# EAGLE schematic vceg (EAGLE 7.1.0)
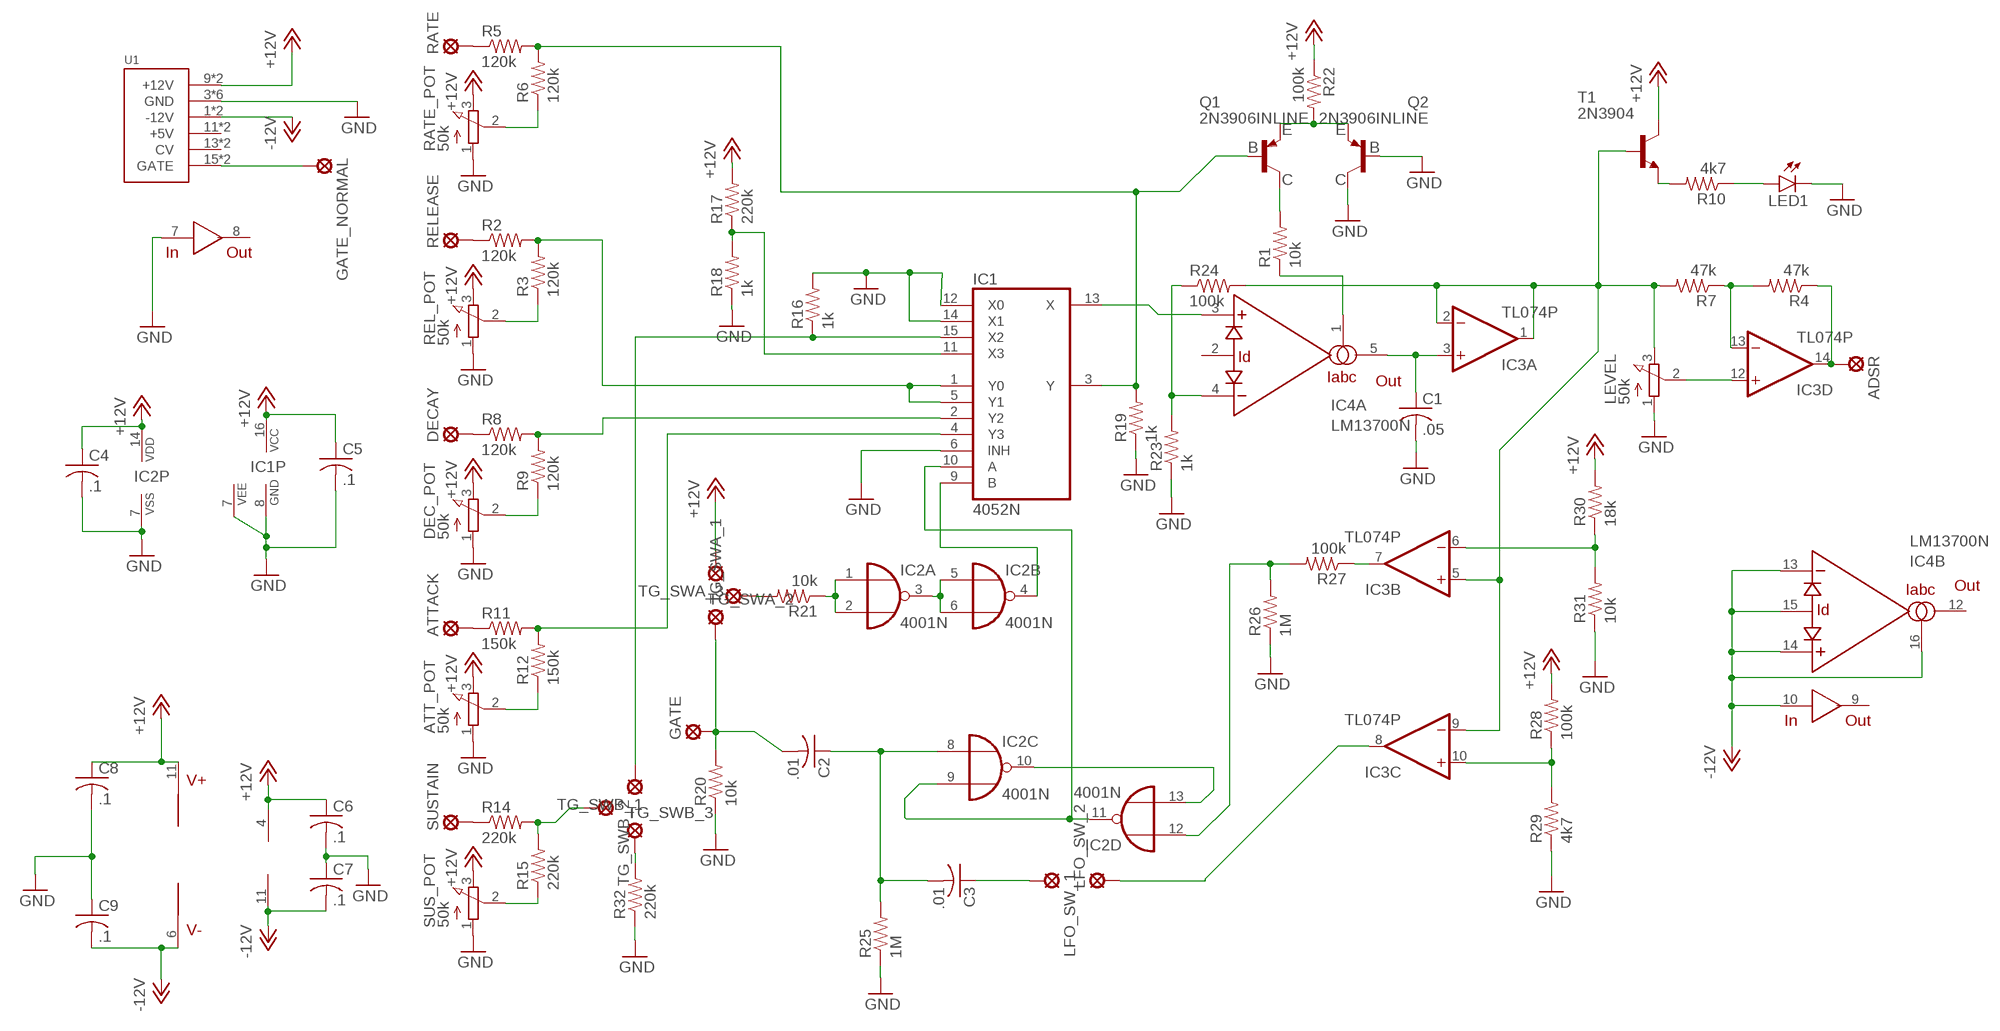
[diagram p0: schematic, sheet 1]

## Parts
ADSR  LSP10  [LSP10]
ATT_POT  50k  3RP/1610N  [3RP/1610N]
ATTACK  LSP10  [LSP10]
C1  .05  C-US025-024X044  [C025-024X044]
C2  .01  C-US025-024X044  [C025-024X044]
C3  .01  C-US025-024X044  [C025-024X044]
C4  .1  C-US025-024X044  [C025-024X044]
C5  .1  C-US025-024X044  [C025-024X044]
C6  .1  C-US025-024X044  [C025-024X044]
C7  .1  C-US025-024X044  [C025-024X044]
C8  .1  C-US025-024X044  [C025-024X044]
C9  .1  C-US025-024X044  [C025-024X044]
DEC_POT  50k  3RP/1610N  [3RP/1610N]
DECAY  LSP10  [LSP10]
GATE  LSP10  [LSP10]
GATE_NORMAL  LSP10  [LSP10]
IC1  4052N  [DIL16]
IC2  4001N  [DIL14]
IC3  TL074P  [DIL14]
IC4  LM13700N  [DIL16]
LED1  LED5MM  [LED5MM]
LEVEL  50k  3RP/1610N  [3RP/1610N]
LFO_SW_1  LSP10  [LSP10]
LFO_SW_2  LSP10  [LSP10]
Q1  2N3906INLINE  [TO92-CBE]
Q2  2N3906INLINE  [TO92-CBE]
R1  10k  RESISTORPTH-1/4W  [AXIAL-0.4]
R2  120k  RESISTORPTH-1/4W  [AXIAL-0.4]
R3  120k  RESISTORPTH-1/4W  [AXIAL-0.4]
R4  47k  RESISTORPTH-1/4W  [AXIAL-0.4]
R5  120k  RESISTORPTH-1/4W  [AXIAL-0.4]
R6  120k  RESISTORPTH-1/4W  [AXIAL-0.4]
R7  47k  RESISTORPTH-1/4W  [AXIAL-0.4]
R8  120k  RESISTORPTH-1/4W  [AXIAL-0.4]
R9  120k  RESISTORPTH-1/4W  [AXIAL-0.4]
R10  4k7  RESISTORPTH-1/4W  [AXIAL-0.4]
R11  150k  RESISTORPTH-1/4W  [AXIAL-0.4]
R12  150k  RESISTORPTH-1/4W  [AXIAL-0.4]
R14  220k  RESISTORPTH-1/4W  [AXIAL-0.4]
R15  220k  RESISTORPTH-1/4W  [AXIAL-0.4]
R16  1k  RESISTORPTH-1/4W  [AXIAL-0.4]
R17  220k  RESISTORPTH-1/4W  [AXIAL-0.4]
R18  1k  RESISTORPTH-1/4W  [AXIAL-0.4]
R19  1k  RESISTORPTH-1/4W  [AXIAL-0.4]
R20  10k  RESISTORPTH-1/4W  [AXIAL-0.4]
R21  10k  RESISTORPTH-1/4W  [AXIAL-0.4]
R22  100k  RESISTORPTH-1/4W  [AXIAL-0.4]
R23  1k  RESISTORPTH-1/4W  [AXIAL-0.4]
R24  100k  RESISTORPTH-1/4W  [AXIAL-0.4]
R25  1M  RESISTORPTH-1/4W  [AXIAL-0.4]
R26  1M  RESISTORPTH-1/4W  [AXIAL-0.4]
R27  100k  RESISTORPTH-1/4W  [AXIAL-0.4]
R28  100k  RESISTORPTH-1/4W  [AXIAL-0.4]
R29  4k7  RESISTORPTH-1/4W  [AXIAL-0.4]
R30  18k  RESISTORPTH-1/4W  [AXIAL-0.4]
R31  10k  RESISTORPTH-1/4W  [AXIAL-0.4]
R32  220k  RESISTORPTH-1/4W  [AXIAL-0.4]
RATE  LSP10  [LSP10]
RATE_POT  50k  3RP/1610N  [3RP/1610N]
REL_POT  50k  3RP/1610N  [3RP/1610N]
RELEASE  LSP10  [LSP10]
SUS_POT  50k  3RP/1610N  [3RP/1610N]
SUSTAIN  LSP10  [LSP10]
T1  2N3904  [TO92]
TG_SWA_1  LSP10  [LSP10]
TG_SWA_2  LSP10  [LSP10]
TG_SWA_3  LSP10  [LSP10]
TG_SWB_1  LSP10  [LSP10]
TG_SWB_2  LSP10  [LSP10]
TG_SWB_3  LSP10  [LSP10]
U1  POWER  [POWER_16]

## Nets
+12V: ATT_POT.3(E) C4.1 C5.1 C6.1 C8.1 DEC_POT.3(E) IC1.16(VCC) IC2.14(P:VDD) IC3.4(P:V+) IC4.11(V+) R17.P$2 R22.P$1 R28.P$2 R30.P$2 RATE_POT.3(E) REL_POT.3(E) SUS_POT.3(E) T1.1(C) TG_SWA_3.MP U1.9(+12V) U1.10(+12V)
-12V: C7.2 C9.2 IC3.11(P:V-) IC4.6(V-) IC4.10(IN) IC4.13(B:-IN) IC4.14(B:+IN) IC4.15(B:ID) IC4.16(B:IABC) U1.1(-12V) U1.2(-12V)
GND: ATT_POT.1(A) C1.2 C4.2 C5.2 C6.2 C7.1 C8.2 C9.1 DEC_POT.1(A) IC1.6(INH) IC1.7(VEE) IC1.8(GND) IC1.12(X0) IC1.14(X1) IC2.7(P:VSS) IC4.7(IN) LED1.K(C) LEVEL.1(A) Q2.B Q2.C R16.P$2 R18.P$1 R19.P$1 R20.P$1 R23.P$1 R25.P$1 R26.P$1 R29.P$1 R31.P$1 R32.P$1 RATE_POT.1(A) REL_POT.1(A) SUS_POT.1(A) U1.3(GND) U1.4(GND) U1.5(GND) U1.6(GND) U1.7(GND) U1.8(GND)
N$1: R2.P$1 RELEASE.MP
N$2: IC1.1(Y0) IC1.5(Y1) R2.P$2 R3.P$2
N$3: R3.P$1 REL_POT.2(S)
N$4: R5.P$1 RATE.MP
N$5: IC1.3(Y) Q1.B R5.P$2 R6.P$2 R19.P$2
N$6: R6.P$1 RATE_POT.2(S)
N$7: DECAY.MP R8.P$1
N$8: IC1.2(Y2) R8.P$2 R9.P$2
N$9: DEC_POT.2(S) R9.P$1
N$10: ATTACK.MP R11.P$1
N$11: IC1.4(Y3) R11.P$2 R12.P$2
N$12: ATT_POT.2(S) R12.P$1
N$13: R14.P$1 SUSTAIN.MP
N$14: IC1.15(X2) R16.P$1 TG_SWB_1.MP
N$15: R15.P$1 SUS_POT.2(S)
N$16: IC1.11(X3) R17.P$1 R18.P$2
N$17: IC1.10(A) IC2.9(C:I1) IC2.11(D:O)
N$18: IC2.1(A:I0) IC2.2(A:I1) R21.P$1
N$19: IC2.3(A:O) IC2.5(B:I0) IC2.6(B:I1)
N$20: IC1.9(B) IC2.4(B:O)
N$21: Q1.C R1.P$2
N$22: Q1.E Q2.E R22.P$2
N$23: GATE_NORMAL.MP U1.15(GATE) U1.16(GATE)
N$24: IC4.4(A:-IN) R23.P$2 R24.P$1
N$25: C2.1 C3.2 IC2.8(C:I0) R25.P$2
N$26: IC3.1(A:OUT) IC3.2(A:-IN) IC3.5(B:+IN) IC3.9(C:-IN) LEVEL.3(E) R7.P$2 R24.P$2 T1.2(B)
N$27: C2.2 GATE.MP R20.P$2 TG_SWA_2.MP
N$28: C1.1 IC3.3(A:+IN) IC4.5(A:OUT)
N$29: IC3.7(B:OUT) R27.P$1
N$30: IC2.10(C:O) IC2.13(D:I1)
N$31: IC2.12(D:I0) R26.P$2 R27.P$2
N$32: IC3.8(C:OUT) LFO_SW_2.MP
N$33: IC3.6(B:-IN) R30.P$1 R31.P$2
N$34: IC3.10(C:+IN) R28.P$1 R29.P$2
N$35: C3.1 LFO_SW_1.MP
N$36: R14.P$2 R15.P$2 TG_SWB_2.MP
N$37: R32.P$2 TG_SWB_3.MP
N$38: R21.P$2 TG_SWA_1.MP
N$39: IC4.1(A:IABC) R1.P$1
N$40: IC3.12(D:+IN) LEVEL.2(S)
N$41: IC1.13(X) IC4.3(A:+IN)
N$42: ADSR.MP IC3.14(D:OUT) R4.P$1
N$43: IC3.13(D:-IN) R4.P$2 R7.P$1
N$44: R10.P$2 T1.3(E)
N$45: LED1.A R10.P$1
Unconnected: IC4.2(A:ID) IC4.8(OUT) IC4.9(OUT) IC4.12(B:OUT) U1.11(+5V) U1.12(+5V) U1.13(CV) U1.14(CV)

## Library data of the parts
ADSR ATTACK DECAY GATE GATE_NORMAL LFO_SW_1 LFO_SW_2 RATE RELEASE SUSTAIN TG_SWA_1-TG_SWA_3 TG_SWB_1-TG_SWB_3 = solpad:LSP10: SOLDER PAD drill 1.0 mm, distributor Buerklin, 12H555
ATT_POT DEC_POT LEVEL RATE_POT REL_POT SUS_POT = pot:3RP/1610N: 16mm Potentiometer one level Source: http://www.alphapotentiometers.net/html/16mm_pot_2.html
C1-C9 = rcl:C-US: CAPACITOR, American symbol
IC1 = 40xx:4052: Dual 4-channel ANALOG MULTIPLEXER
IC2 = 40xx:4001: Quad 2-input NOR
IC3 = linear:TL074: OP AMP
IC4 = synthdiy:LM13700: National Dual OTA with buffers.
LED1 = SparkFun-LED:LED: LEDs Standard schematic elements and footprints for 5mm, 3mm, 1206, and 0603 sized LEDs. 5mm - Spark Fun Electronics SKU : COM-00529 (and others)
Q1 Q2 = bt_transistor:2N3906: PNP Transistor Small signal PNP Bipolar Junction Transistor (BJT). Use this device to represent any of a number of such transistors with similar package and pinout: 2N4402, 2N3906, etc.
R1-R12 R14-R32 = SparkFun-Resistors:RESISTOR: Resistor Basic schematic elements and footprints for 0603, 1206, and PTH resistors.
T1 = transistor:2N3904: NPN TRANSISTOR
U1 = eurorack:POWER